# EAGLE design 1ChAmp_circuit_Large (EAGLE 7.3.0)
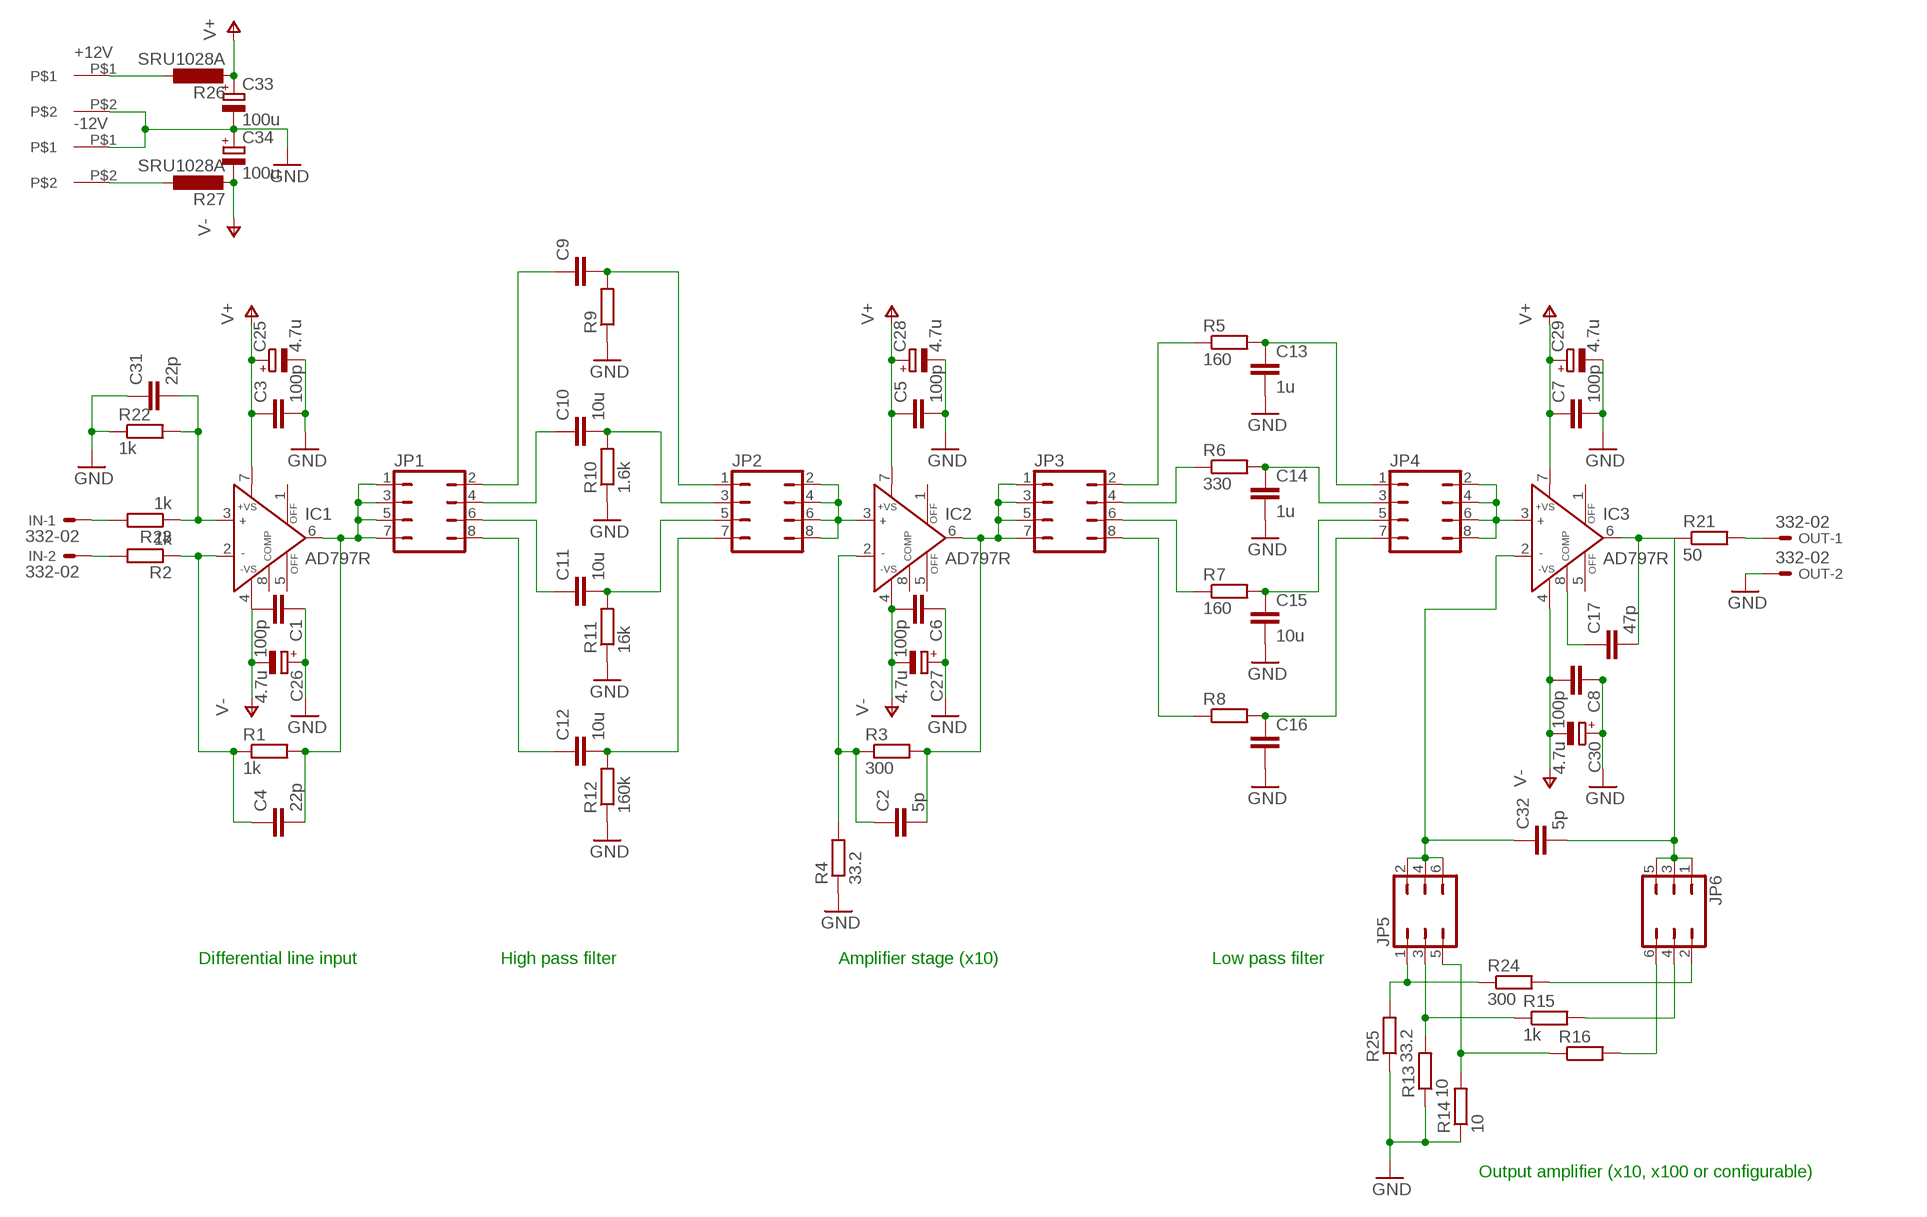
[diagram p0: schematic, sheet 1]

## Parts
+12V  B2P-VH  [B2P-VH]
-12V  B2P-VH  [B2P-VH]
C1  100p  C-EUC0805  [C0805]
C2  5p  C-EUC0805  [C0805]
C3  100p  C-EUC0805  [C0805]
C4  22p  C-EUC0805  [C0805]
C5  100p  C-EUC0805  [C0805]
C6  100p  C-EUC0805  [C0805]
C7  100p  C-EUC0805  [C0805]
C8  100p  C-EUC0805  [C0805]
C9  C-EU025-025X050  [C025-025X050]
C10  10u  C-EUC0805  [C0805]
C11  10u  C-EUC0805  [C0805]
C12  10u  C-EUC0805  [C0805]
C13  1u  C-EUC0805  [C0805]
C14  1u  C-EUC0805  [C0805]
C15  10u  C-EUC0805  [C0805]
C16  C-EU025-025X050  [C025-025X050]
C17  47p  C-EUC0805  [C0805]
C25  4.7u  CPOL-EU  [C0805POL]
C26  4.7u  CPOL-EU  [C0805POL]
C27  4.7u  CPOL-EU  [C0805POL]
C28  4.7u  CPOL-EU  [C0805POL]
C29  4.7u  CPOL-EU  [C0805POL]
C30  4.7u  CPOL-EU  [C0805POL]
C31  22p  C-EUC0805  [C0805]
C32  5p  C-EUC0805  [C0805]
C33  100u  CPOL-EU  [C0805POL]
C34  100u  CPOL-EU  [C0805POL]
IC1  AD797R  [SO8]
IC2  AD797R  [SO8]
IC3  AD797R  [SO8]
IN  332-02  [332-02]
JP1  JP4Q  [JP4Q]
JP2  JP4Q  [JP4Q]
JP3  JP4Q  [JP4Q]
JP4  JP4Q  [JP4Q]
JP5  JP3Q  [JP3Q]
JP6  JP3Q  [JP3Q]
OUT  332-02  [332-02]
R1  1k  R-EU_R0805  [R0805]
R2  1k  R-EU_R0805  [R0805]
R3  300  R-EU_R0805  [R0805]
R4  33.2  R-EU_R0805  [R0805]
R5  160  R-EU_R0805  [R0805]
R6  330  R-EU_R0805  [R0805]
R7  160  R-EU_R0805  [R0805]
R8  R-EU_0204/5  [0204/5]
R9  R-EU_0204/5  [0204/5]
R10  1.6k  R-EU_R0805  [R0805]
R11  16k  R-EU_R0805  [R0805]
R12  160k  R-EU_R0805  [R0805]
R13  10  R-EU_R0805  [R0805]
R14  10  R-EU_R0805  [R0805]
R15  1k  R-EU_R0805  [R0805]
R16  R-EU_0204/5  [0204/5]
R21  50  R-EU_0204/5  [0204/5]
R22  1k  R-EU_R0805  [R0805]
R23  1k  R-EU_R0805  [R0805]
R24  300  R-EU_R0805  [R0805]
R25  33.2  R-EU_R0805  [R0805]
R26  SRU1028A  [SRU1028A]
R27  SRU1028A  [SRU1028A]

## Nets
GND: +12V.P$2 -12V.P$1 C1.1 C3.2 C5.2 C6.1 C7.2 C8.1 C13.2 C14.2 C15.2 C16.2 C25.P$1(-) C26.P$2(+) C27.P$2(+) C28.P$1(-) C29.P$1(-) C30.P$2(+) C31.1 C33.P$1(-) C34.P$2(+) OUT.2 R4.1 R9.1 R10.1 R11.1 R12.1 R13.1 R14.1 R22.1 R25.1
N$1: IN.2 R2.2
N$2: OUT.1 R21.2
N$3: IN.1 R23.2
N$4: C31.2 IC1.3(IN+) R22.2 R23.1
N$5: JP5.5 R14.2 R16.1
N$6: C13.1 JP4.1 R5.2
N$7: C4.1 IC1.2(IN-) R1.1 R2.1
N$8: C4.2 IC1.6(OUT) JP1.1 JP1.3 JP1.5 JP1.7 R1.2
N$9: C2.1 IC2.2(IN-) R3.1 R4.2
N$10: C2.2 IC2.6(OUT) JP3.1 JP3.3 JP3.5 JP3.7 R3.2
N$11: C14.1 JP4.3 R6.2
N$12: C17.1 IC3.8(COMP)
N$13: C15.1 JP4.5 R7.2
N$14: C17.2 C32.2 IC3.6(OUT) JP6.1 JP6.3 JP6.5 R21.1
N$15: +12V.P$1 R26.P$1
N$16: C16.1 JP4.7 R8.2
N$17: JP5.3 R13.2 R15.1
N$18: C9.2 JP2.1 R9.2
N$19: JP5.1 R24.1 R25.2
N$20: C10.2 JP2.3 R10.2
N$21: JP6.2 R24.2
N$22: C11.2 JP2.5 R11.2
N$23: JP6.4 R15.2
N$24: C12.2 JP2.7 R12.2
N$25: JP6.6 R16.2
N$26: C32.1 IC3.2(IN-) JP5.2 JP5.4 JP5.6
N$27: C9.1 JP1.2
N$29: C10.1 JP1.4
N$30: C11.1 JP1.6
N$31: C12.1 JP1.8
N$32: IC2.3(IN+) JP2.2 JP2.4 JP2.6 JP2.8
N$33: JP3.2 R5.1
N$34: JP3.4 R6.1
N$35: JP3.6 R7.1
N$36: JP3.8 R8.1
N$37: IC3.3(IN+) JP4.2 JP4.4 JP4.6 JP4.8
N$40: -12V.P$2 R27.P$1
V+: C3.1 C5.1 C7.1 C25.P$2(+) C28.P$2(+) C29.P$2(+) C33.P$2(+) IC1.7(+VS) IC2.7(+VS) IC3.7(+VS) R26.P$2
V-: C1.2 C6.2 C8.2 C26.P$1(-) C27.P$1(-) C30.P$1(-) C34.P$1(-) IC1.4(-VS) IC2.4(-VS) IC3.4(-VS) R27.P$2
Unconnected: IC1.1(OFF) IC1.5(OFF) IC1.8(COMP) IC2.1(OFF) IC2.5(OFF) IC2.8(COMP) IC3.1(OFF) IC3.5(OFF)

## Notes on the sheet
- Differential line input | High pass filter | Amplifier stage (x10) | Low pass filter
- Output amplifier (x10, x100 or configurable)

## Library data of the parts
+12V -12V = con-jst:B2P-VH: 2pin connector with 3.96mm pitch
C1-C17 C31 C32 = rcl:C-EU: CAPACITOR, European symbol
C25-C30 C33 C34 = rcl:CPOL-EU: POLARIZED CAPACITOR, European symbol
IC1-IC3 = analog-devices:AD797: Ultralow Distortion, Ultralow Noise Op Amp Source: http://www.analog.com/static/imported-files/data_sheets/AD797.pdf; MF: ALTERA CORPORATION; MPN: AD797ARZ; OC_FARNELL: 9426450; OC_NEWARK: 88H0085
IN OUT = con-garry:332-02: 2 Pin - 2mm Dual Row Source: www.mpe-connector.de / garry_shortform_2012.pdf
JP1-JP4 = jumper:JP4Q: JUMPER
JP5 JP6 = jumper:JP3Q: JUMPER
R1-R7 R9-R16 R21-R25 = rcl:R-EU_: RESISTOR, European symbol
R8 = resistor:R-EU_: RESISTOR, European symbol
R26 R27 = rcl:SRU1028A: SMD power inductor

## Board
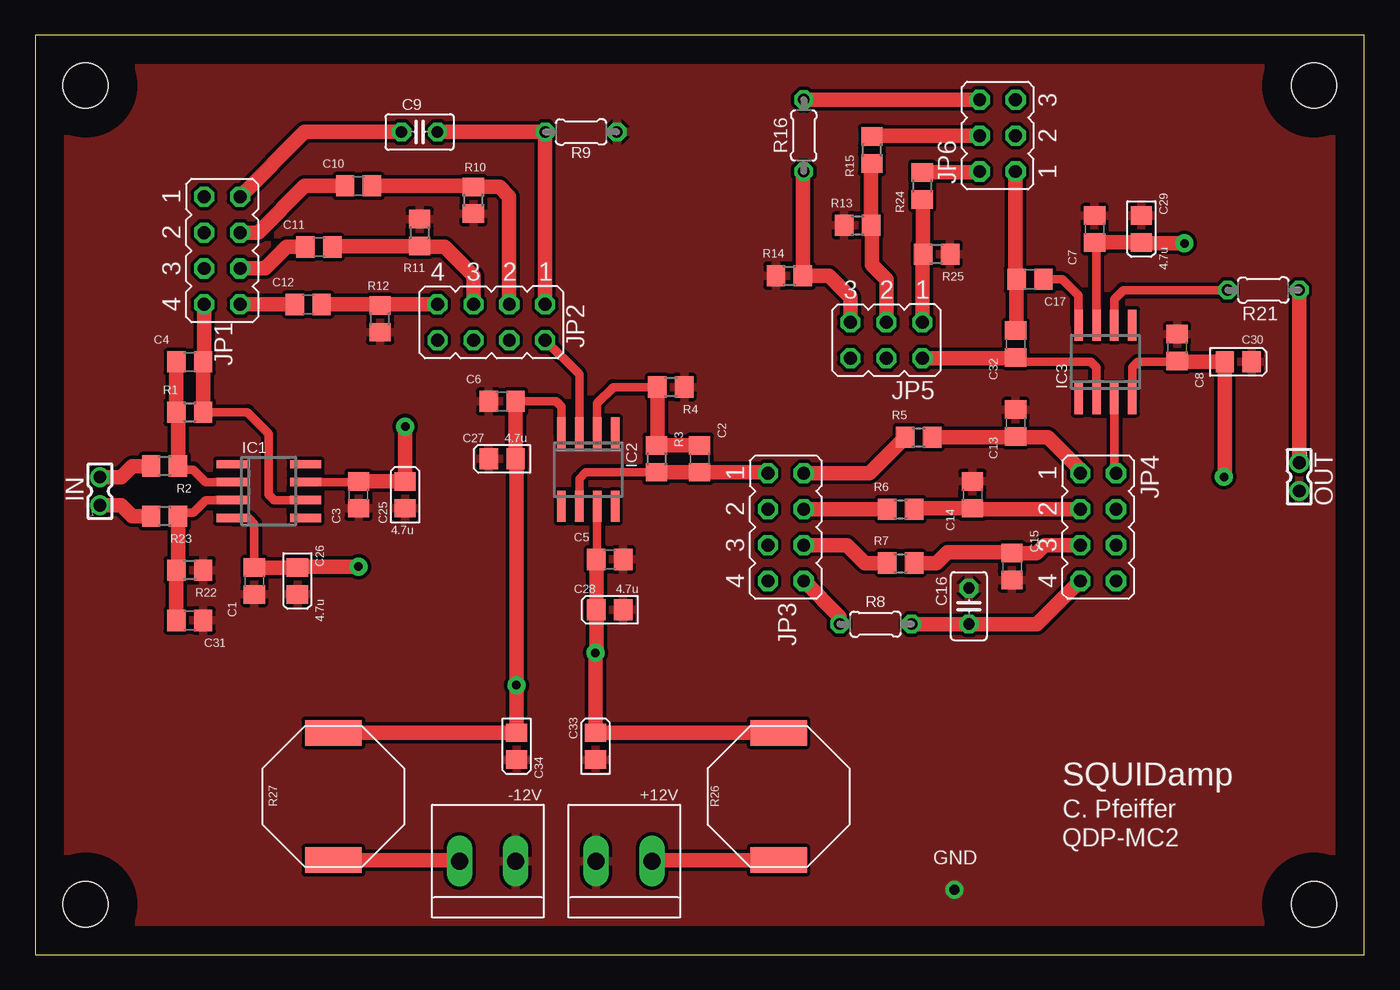
[diagram p1: board, top side]
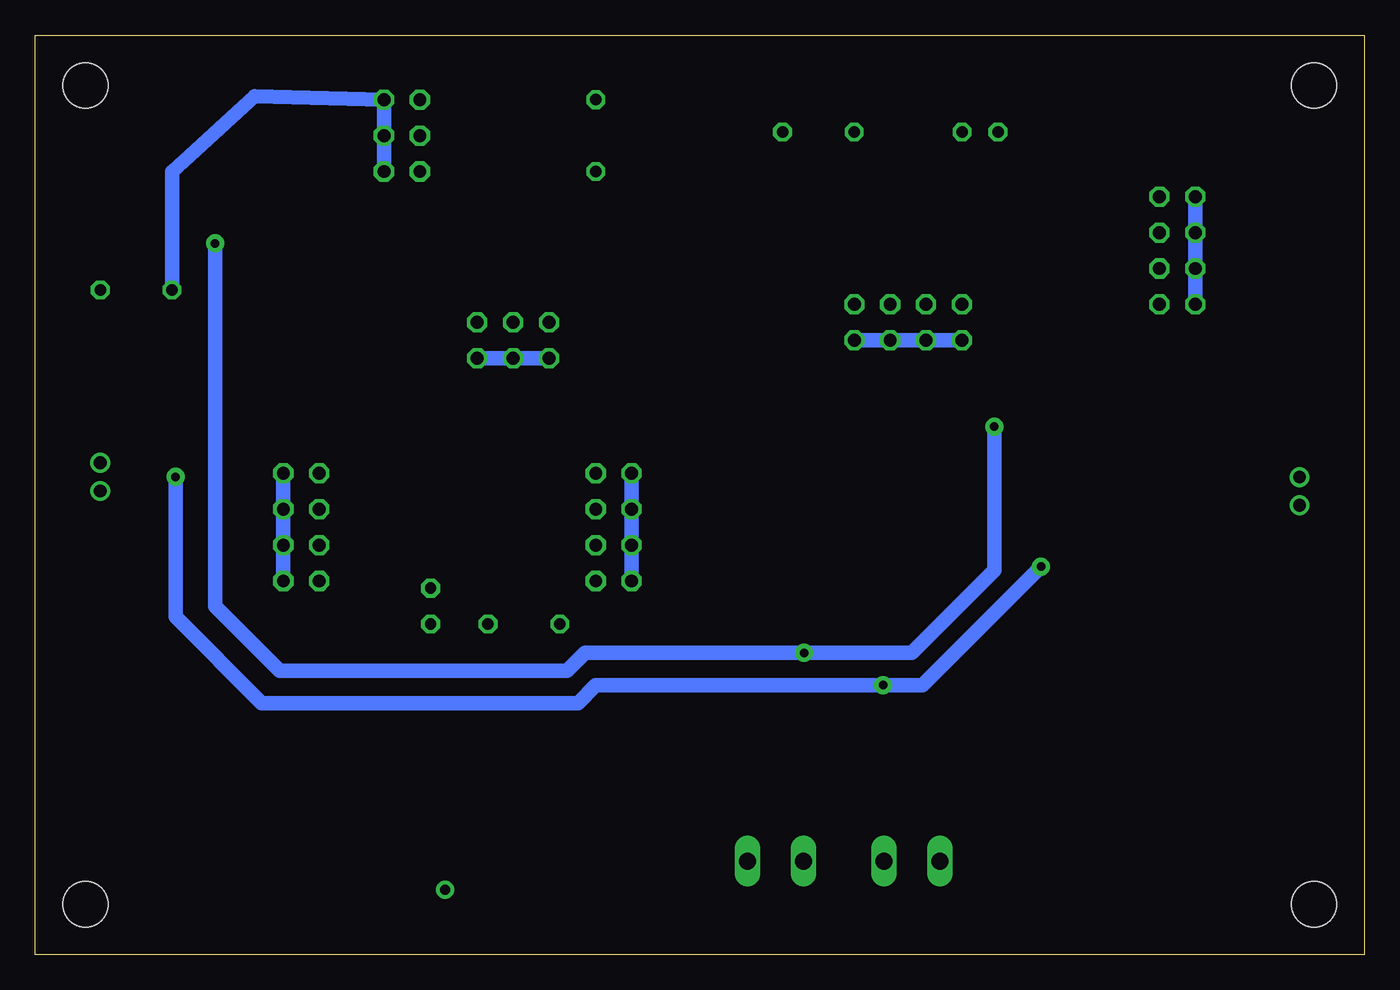
[diagram p2: board, bottom side, seen from below]

Size 94 x 65 mm. Coordinates in mm from the lower left corner, seen from the top.
Outline: 0,0 94,0 94,65 0,65 0,0
Copper layers (1*16): Top 0.035mm / dielectric 1.5mm / Bottom 0.035mm
Design rules "default *": minimum track width 6mil, minimum drill 12mil, track to track 6mil, track to pad 6mil, pad to pad 6mil, via to via 6mil, smd to smd 6mil, copper to edge 80mil, drill to drill 50mil, minimum pad ring 10mil, minimum via ring 8mil, stop-mask expansion 4mil, vias tented up to drill 0mil, thermal gap 10mil
Holes 3.2 mm at 3.56,3.56 3.56,61.44 90.44,3.56 90.44,61.44

### Footprints (pad centres in the part's own frame; a part is rotated, then mirrored left to right if it is on the bottom)
B2P-VH = drill 1.2 long: P$1 -1.98,0; P$2 1.98,0
C0805 = smd 1.3 x 1.5: 1 -0.95,0; 2 0.95,0
C025-025X050 = drill 0.813 octagon: 1 -1.27,0; 2 1.27,0
C0805POL = smd 1.3 x 1.5: P$1 -0.95,0; P$2 0.95,0
SO8 = smd 0.6 x 2.2: 1 -1.905,-2.6; 2 -0.635,-2.6; 3 0.635,-2.6; 4 1.905,-2.6; 5 1.905,2.6; 6 0.635,2.6; 7 -0.635,2.6; 8 -1.905,2.6
332-02 = drill 0.9 pad 1.27: 1 0,-1; 2 0,1
JP4Q = drill 0.914 octagon: 1 -3.81,-1.27; 2 -3.81,1.27; 3 -1.27,-1.27; 4 -1.27,1.27; 5 1.27,-1.27; 6 1.27,1.27; 7 3.81,-1.27; 8 3.81,1.27
JP3Q = drill 0.914 octagon: 1 -2.54,-1.27; 2 -2.54,1.27; 3 0,-1.27; 4 0,1.27; 5 2.54,-1.27; 6 2.54,1.27
R0805 = smd 1.3 x 1.5: 1 -0.95,0; 2 0.95,0
0204/5 = drill 0.813 octagon: 1 -2.54,0; 2 2.54,0
SRU1028A = smd 1.8 x 4: P$1 -4.5,0; P$2 4.5,0

### Placement (x,y rotation side)
+12V  41.66,6.6 180 top
-12V  32,6.6 180 top
C1  15.49,26.42 90 top
C2  46.99,35.05 270 top
C3  22.86,32.51 270 top
C4  10.92,41.91 0 top
C5  40.64,27.94 0 top
C6  33.02,39.12 0 top
C7  74.93,51.31 90 top
C8  80.77,42.93 270 top
C9  27.18,58.17 0 top
C10  22.86,54.36 0 top
C11  20.07,50.04 0 top
C12  19.3,45.97 0 top
C13  69.34,37.59 90 top
C14  66.29,32.51 90 top
C15  69.09,27.43 270 top
C16  66.04,24.64 90 top
C17  70.36,47.75 180 top
C25  26.16,32.51 90 top
C26  18.54,26.42 270 top
C27  33.02,35.05 180 top
C28  40.64,24.38 180 top
C29  78.23,51.31 270 top
C30  85.09,41.91 0 top
C31  10.92,23.62 180 top
C32  69.34,43.18 90 top
C33  39.62,14.73 90 top
C34  34.04,14.73 270 top
IC1  16.51,32.77 270 top
IC2  39.12,34.29 180 top
IC3  75.69,41.91 0 top
IN  4.57,32.77 0 top
JP1  13.21,49.78 270 top
JP2  32.26,44.7 180 top
JP3  53.09,30.23 270 top
JP4  75.18,30.23 270 top
JP5  60.2,43.43 180 top
JP6  68.07,57.91 90 top
OUT  89.41,33.78 180 top
R1  10.92,38.35 0 top
R2  9.14,34.54 180 top
R3  43.94,35.05 270 top
R4  44.96,40.13 180 top
R5  62.48,36.58 0 top
R6  61.21,31.5 0 top
R7  61.21,27.69 0 top
R8  59.44,23.37 0 top
R9  38.61,58.17 180 top
R10  30.99,53.34 90 top
R11  27.18,51.05 270 top
R12  24.38,44.96 90 top
R13  58.17,51.56 0 top
R14  53.34,48.01 0 top
R15  59.18,56.9 90 top
R16  54.36,57.91 90 top
R21  86.87,46.99 0 top
R22  10.92,27.18 180 top
R23  9.14,30.99 180 top
R24  62.74,54.36 90 top
R25  63.75,49.53 180 top
R26  52.58,11.18 90 top
R27  21.08,11.18 90 top

### Tracks (layer width: path | path; a pad name or v marks a point on that pad's centre or on a via)
GND  (via drill 0.7 pad 1.27)
  other vias: 65.02,4.57
  pour Top (isolate 0.254): 0,65 0,0 94,0 94,65
N$1
  Top 1.016: IN.2 6.08,33.77 6.86,34.54 R2.2
N$2
  Top 1.016: OUT.1 R21.2
N$3
  Top 1.016: IN.1 6.08,31.77 6.86,30.99 R23.2
N$4
  Top 0.61: IC1.3 12.06,32.13 11.18,31.24 10.35,31.24 R23.1
  Top 1.016: R22.2 9.97,26.67 | 9.97,26.67 C31.2 | R23.1 10.09,26.79 9.97,26.67
N$5
  Top 1.016: R16.1 54.29,55.31 R14.2 56.13,48.01 57.66,46.48 JP5.5
N$6
  Top 1.016: R5.2 69.28,36.58 C13.1 69.41,36.58 71.63,36.58 73.91,34.29 JP4.1
N$7
  Top 0.61: IC1.2 12.06,33.4 11.18,34.29 10.35,34.29 R2.1
  Top 1.016: R2.1 10.09,38.23 R1.1 C4.1
N$8
  Top 0.61: IC1.6 16.89,32.13 16.51,32.51 16.51,36.83 14.99,38.35 R1.2
  Top 1.016: R1.2 C4.2 11.94,41.98 JP1.7
  Bottom 1.016: JP1.1 JP1.3 JP1.5 JP1.7
N$9
  Top 0.61: IC2.2 39.75,38.99 40.89,40.13 R4.2
  Top 1.016: R4.2 44.01,36.07 R3.1 C2.1
N$10
  Top 0.61: R3.2 38.93,34.1 38.48,33.66 IC2.6
  Top 1.016: R3.2 C2.2 51.75,34.1 JP3.1
  Bottom 1.016: JP3.1 JP3.3 JP3.5 JP3.7
N$11
  Top 1.016: R6.2 62.23,31.56 C14.1 66.36,31.5 JP4.3
N$12
  Top 0.61: IC3.8 73.79,46.61 72.64,47.75 C17.1
N$13
  Top 1.016: R7.2 63.75,27.69 64.52,28.45 69.02,28.45 C15.1 70.8,28.38 71.37,28.96 JP4.5
N$14
  Top 0.61: IC3.6 76.33,46.35 76.96,46.99 R21.1
  Top 1.016: C32.2 69.41,44.2 C17.2 69.34,47.82 JP6.1
  Bottom 1.016: JP6.1 JP6.3 JP6.5 78.49,60.71 84.33,55.37 R21.1
N$15
  Top 1.016: R26.P$1 43.71,6.68 +12V.P$1
N$16
  Top 1.016: R8.2 C16.1 70.87,23.37 JP4.7
N$17
  Top 1.016: JP5.3 60.2,47.75 59.18,48.77 59.18,51.5 R13.2 59.12,55.88 R15.1
N$18
  Top 1.016: JP2.1 R9.2 C9.2
N$19
  Top 1.016: JP5.1 62.74,49.46 R25.2 62.8,53.34 R24.1
N$20
  Top 1.016: C10.2 30.92,54.36 R10.2 32.83,54.29 33.53,53.59 JP2.3
N$21
  Top 1.016: R24.2 66.74,55.31 JP6.2
N$22
  Top 1.016: C11.2 21.08,50.1 R11.2 27.24,50.04 28.96,50.04 30.99,48.01 JP2.5
N$23
  Top 1.016: JP6.4 59.25,57.91 R15.2
N$24
  Top 1.016: JP2.7 24.45,45.97 R12.2 24.32,45.97 C12.2
N$25
  Top 1.016: JP6.6 R16.2
N$26
  Top 0.61: IC3.2 75.06,41.53 74.68,41.91 69.66,41.91 C32.1
  Top 1.016: JP5.2 69.28,42.16 C32.1
  Bottom 1.016: JP5.6 JP5.4 JP5.2
N$27
  Top 1.016: JP1.2 19.05,58.17 C9.1
N$29
  Top 1.016: JP1.4 15.75,51.05 19.05,54.36 C10.1
N$30
  Top 1.016: JP1.6 16.26,48.51 17.78,50.04 C11.1
N$31
  Top 1.016: JP1.8 C12.1
N$32
  Top 0.61: IC2.3 38.48,41.02 JP2.2
  Bottom 1.016: JP2.2 JP2.4 JP2.6 JP2.8
N$33
  Top 1.016: R5.1 58.99,34.04 JP3.2
N$34
  Top 1.016: JP3.4 R6.1
N$35
  Top 1.016: R7.1 58.67,27.69 57.4,28.96 JP3.6
N$36
  Top 1.016: JP3.8 56.9,23.88 R8.1
N$37
  Top 0.61: IC3.3 76.33,34.42 JP4.2
  Bottom 1.016: JP4.2 JP4.4 JP4.6 JP4.8
N$40
  Top 1.016: R27.P$1 29.95,6.68 -12V.P$2
V+  (via drill 0.6 pad 1.27)
  Top 0.61: IC3.7 75.06,50.23 C7.1 | IC1.7 22.86,33.4 C3.1 | IC2.7 39.75,28 C5.1
  Top 1.016: C3.1 C25.P$2 v26.16,37.34 | 75.06,50.23 75.18,50.36 C29.P$2 78.3,50.29 v81.28,50.29 | C5.1 C28.P$2 39.69,21.4 v39.62,21.34 C33.P$2 R26.P$2
  Bottom 1.016: v26.16,37.34 26.16,27.18 32,21.34 v39.62,21.34 55.12,21.34 56.39,20.07 76.71,20.07 81.28,24.64 v81.28,50.29
V-  (via drill 0.6 pad 1.27)
  Top 0.61: IC1.4 15.11,30.86 15.49,30.48 C1.2 | IC3.4 77.6,41.53 77.98,41.91 80.71,41.91 C8.2 | IC2.4 37.21,38.73 36.83,39.12 C6.2
  Top 1.016: C1.2 C26.P$1 18.61,27.43 v22.86,27.43 | C30.P$1 84.07,41.84 | C8.2 80.84,41.91 C30.P$1 | C30.P$1 84.14,33.85 v84.07,33.78 | C6.2 C27.P$1 34.04,35.05 v34.04,19.05 C34.P$1 R27.P$2
  Bottom 1.016: v84.07,33.78 84.07,23.88 77.98,17.78 55.63,17.78 54.36,19.05 v34.04,19.05 | 33.53,19.05 v34.04,19.05 | v22.86,27.43 31.24,19.05 v34.04,19.05

### Text on the board
tNames: SQUIDamp | C. Pfeiffer | QDP-MC2 | GND
tValues: + | + | + | - | + | GND | + | + | + | + | +
Document: Gain: / 10x(10-100-X) | High pass: / 0.1-1-10-X Hz | Low pass: / X-100-500-1000 Hz